# EasyEDA Pro project 通用F405飞控_2025-10-26.epro, board PCB2
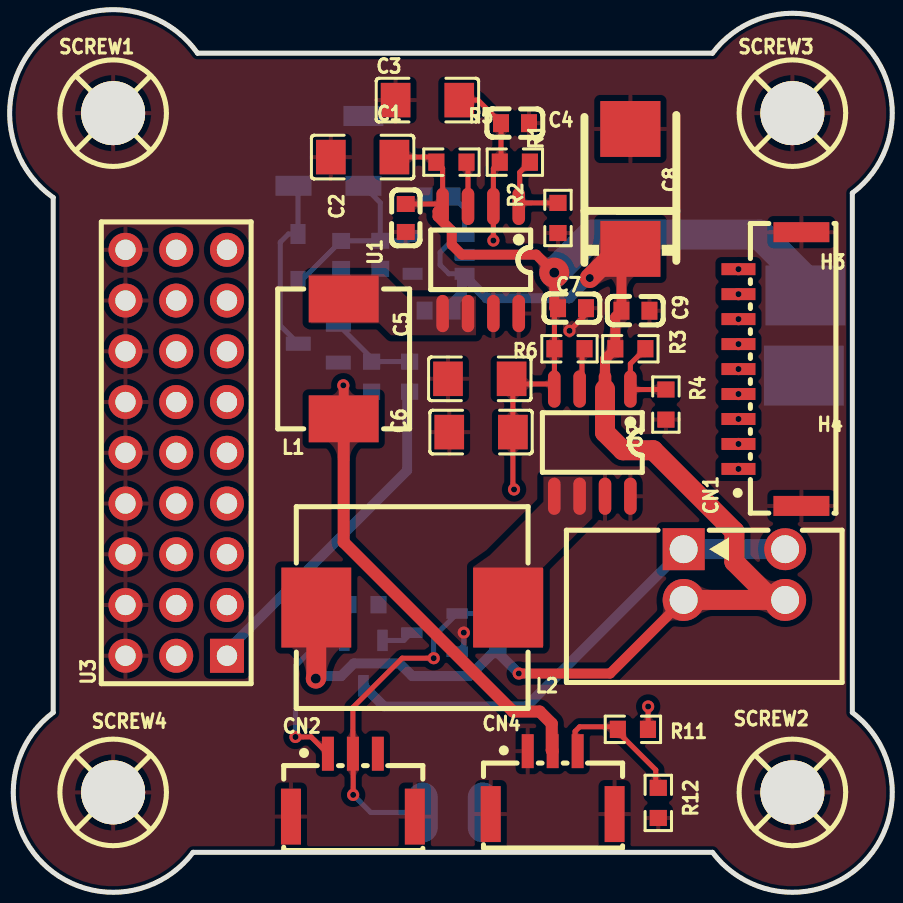
[diagram p5: board, top side]
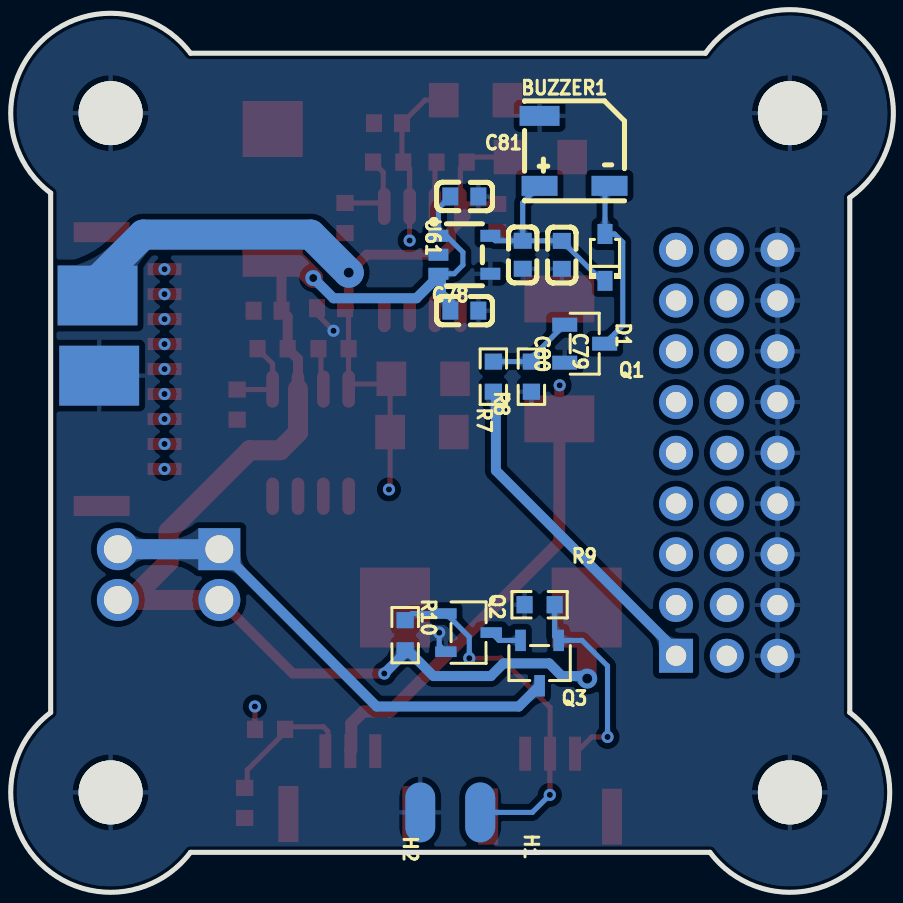
[diagram p6: board, bottom side, seen from below]

Outline 44.18 x 44.18 mm; copper layers: Top Layer, Inner1, Inner2, Bottom Layer. Coordinates in mm from the lower left corner of the outline.
Outline path: 2.18,34.77 arc(1.52,42.66) 9.41,42 35.18,42 arc(42.72,42.53) 42.18,35 42.18,9 arc(42.72,1.46) 35.18,2 9.18,2 arc(1.65,1.46) 2.18,9 2.18,34.77
Stack: Top Layer 0.035mm 外层铜厚1oz / Dielectric1 0.2104mm 7628 RC49% 8.6mil / Inner1 0.0152mm 内层铜厚 / Dielectric2 1.065mm 1.1mm H/HOZ Copper / Inner2 0.0152mm 内层铜厚 / Dielectric3 0.2104mm 7628 RC49% 8.6mil / Bottom Layer 0.035mm 外层铜厚1oz

## Design rules (mm)
template: JLCPCB Capability(Two Layers Board)
spacing copperThickness1oz (default): track to track 0.102, other pairs 0.152 to 0.3
spacing copperThickness2oz: track to track 0.203, other pairs 0.152 to 0.3
track width copperThickness1oz (default): min 0.127, default 0.254, max 2.54
track width copperThickness2oz: min 0.203, default 0.254, max 2.54
differential pair differentialPair (default): width min 0.127, default 0.254, max 2.54; gap min 0.152, default 0.152
via viaSize (default): diameter min 0.5, default 0.61, max 10; hole min 0.3, default 0.305, max 6.3

## Placement (name value [footprint] x y rotation side)
BUZZER1  4kHz  [BUZ-SMD_FST-5020]  15.96 37.11 180 bottom
C1  10uF  [C1206]  17.67 36.8 180 top
C2  100nF  [C0603]  19.83 33.75 270 top
C3  10uF  [C1206]  20.91 39.65 0 top
C4  100nF  [C0603]  25.3 38.5 0 top
C5  10uF  [C1206]  23.54 25.7 180 top
C6  10uF  [C1206]  23.6 23.03 180 top
C7  100nF  [C0603]  28.15 29.23 0 top
C8  330uF  [CASE-D_7343]  31.07 35.2 270 top
C9  100nF  [C0603]  31.33 29.11 0 top
C78  100nF  [C0603]  21.48 29.11 0 bottom
C79  100nF  [C0603]  16.6 31.9 90 bottom
C80  10uF  [C0603]  18.55 31.91 90 bottom
C81  10uF  [C0603]  21.48 34.83 0 bottom
CN1  WAFER-GH1.25-9PWB  [CONN-SMD_9P-P1.25_XUNPU_WAFER-GH1.25-9PWB]  38.06 26.19 90 top
CN2  gpio  [CONN-TH_3P-P1.25_GH1.25]  17.18 5.36 0 top
CN3  2stage_fire  [CONN-TH_2P-P2.54_KF141R-2.54-2P]  36.28 15.9 270 top
CN4  power  [CONN-TH_3P-P1.25_GH1.25]  27.18 5.49 0 top
D1  1N4148WS  [SOD-323_L1.8-W1.3-LS2.5-RD]  14.44 31.77 90 bottom
H1  safe  [焊盘]  20.68 4 90 bottom
H2  -  [焊盘]  23.68 4 90 bottom
H3  -  [电池焊盘]  39.84 29.87 0 top
H4  -  [电池焊盘]  39.76 25.86 0 top
L1  10uH  [IND-SMD_L7.3-W6.8]  16.72 26.69 270 top
L2  10uH  [IND-SMD_L11.6-W10.1]  20.15 14.25 180 top
Q1  SS8050  [SOT-23-3_L2.9-W1.3-P1.90-LS2.4-BR]  15.45 27.46 0 bottom
Q2  SI2300_C727150  [SOT-23-3_L2.9-W1.4-P1.91-LS2.6-BR]  21.27 12.99 0 bottom
Q3  SI2300_C727150  [SOT-23-3_L2.9-W1.4-P1.91-LS2.6-BR]  17.71 11.47 90 bottom
R1  100kΩ  [R0603]  25.29 36.54 0 top
R2  24.9kΩ  [R0603]  27.45 33.75 270 top
R3  100kΩ  [R0603]  31.07 27.2 0 top
R4  24.9kΩ  [R0603]  32.85 24.41 270 top
R5  100kΩ  [R0603]  22.12 36.54 180 top
R6  100kΩ  [R0603]  28.03 27.2 180 top
R7  1kΩ  [R0603]  20.03 25.81 90 bottom
R8  10kΩ  [R0603]  18.12 25.81 270 bottom
R9  10k  [R0603]  17.71 14.39 0 bottom
R10  10k  [R0603]  24.44 12.87 90 bottom
R11  20kΩ  [R0603]  31.2 8.15 0 top
R12  1kΩ  [R0603]  32.47 4.47 90 top
SCREW1  -  [M3螺丝]  5.18 39 0 top
SCREW2  -  [M3螺丝]  39.18 5 0 top
SCREW3  -  [M3螺丝]  39.18 39 0 top
SCREW4  -  [M3螺丝]  5.18 5 0 top
U1  NDP23511KC  [SOP-8_L4.9-W3.9-P1.27-LS6.0-BL]  23.58 31.65 180 top
U2  NDP23511KC  [SOP-8_L4.9-W3.9-P1.27-LS6.0-BL]  29.17 22.5 180 top
U3  KH-2.54PH180-3X9P-L11.5  [HDR-TH_27P-P2.54-V-M-R3-C9-S5.08]  8.34 22 90 top
U61  ME6217C33M5G  [SOT-23-5_L3.0-W1.7-P0.95-LS2.8-BR]  21.48 31.91 0 bottom

## Footprints (pads in the part's own frame, mm; a bottom-side part is the same pattern mirrored in y, then rotated)
BUZ-SMD_FST-5020
  rect 1.8x1 smd: 1(-1.75,-1.75) 2(1.75,-1.75)
  rect 2x1 smd: 3(-1.75,1.75)
C0603
  rect 0.8x0.9 smd: 1(-0.7,0) 2(0.7,0)
C1206
  rect 1.485x1.728 smd: 1(-1.593,0) 2(1.593,0)
CASE-D_7343
  rect 2.799x3.01 smd: 1(3,0) 2(-3,0)
CONN-SMD_9P-P1.25_XUNPU_WAFER-GH1.25-9PWB
  rect 0.6x1.7 smd: 1(-5,1.575) 2(-3.75,1.575) 3(-2.5,1.575) 4(-1.25,1.575) 5(0,1.575) 6(1.25,1.575) 7(2.5,1.575) 8(3.75,1.575) 9(5,1.575)
  rect 1x2.8 smd: 10(6.85,-1.575) 11(-6.85,-1.575)
CONN-TH_2P-P2.54_KF141R-2.54-2P
  round 2.1 hole 1.4: 1(-1.27,2.54) 2(1.27,2.54) 2(1.27,-2.54)
  rect 2.1x2.1 hole 1.4: 1(-1.27,-2.54)
CONN-TH_3P-P1.25_GH1.25
  rect 0.6x1.7 smd: 1(-1.25,1.575) 2(0,1.575) 3(1.25,1.575)
  rect 1x2.8 smd: 4(3.1,-1.575) 5(-3.1,-1.575)
HDR-TH_27P-P2.54-V-M-R3-C9-S5.08
  rect 1.7x1.7 hole 1.02: 1(-10.16,-2.54)
  round 1.7 hole 1.02: 2(-10.16,0) 3(-10.16,2.54) 4(-7.62,-2.54) 5(-7.62,0) 6(-7.62,2.54) 7(-5.08,-2.54) 8(-5.08,0) 9(-5.08,2.54) 10(-2.54,-2.54) 11(-2.54,0) 12(-2.54,2.54) 13(0,-2.54) 14(0,0) 15(0,2.54) 16(2.54,-2.54) 17(2.54,0) 18(2.54,2.54) 19(5.08,-2.54) 20(5.08,0) 21(5.08,2.54) 22(7.62,-2.54) 23(7.62,0) 24(7.62,2.54) 25(10.16,-2.54) 26(10.16,0) 27(10.16,2.54)
IND-SMD_L7.3-W6.8
  rect 2.35x3.5 smd: 1(-3,0) 2(3,0)
IND-SMD_L11.6-W10.1
  rect 3.5x4 smd: 1(-4.8,0) 2(4.8,0)
M3螺丝
  round 3.2 hole 3.2: 1(0,0)
R0603
  rect 0.806x0.864 smd: 1(-0.753,0) 2(0.753,0)
SOD-323_L1.8-W1.3-LS2.5-RD
  rect 1x0.75 smd: 1(-1.173,0) 2(1.173,0)
SOP-8_L4.9-W3.9-P1.27-LS6.0-BL
  oval 0.63x1.865 smd: 1(-1.905,-2.683) 2(-0.635,-2.683) 3(0.635,-2.683) 4(1.905,-2.683) 5(1.905,2.683) 6(0.635,2.683) 7(-0.635,2.683) 8(-1.905,2.683)
SOT-23-3_L2.9-W1.3-P1.90-LS2.4-BR
  rect 1.25x0.7 smd: 1(1,-0.95) 2(1,0.95) 3(-1,0)
SOT-23-3_L2.9-W1.4-P1.91-LS2.6-BR
  rect 1.07x0.532 smd: 1(1.135,-0.955) 2(1.135,0.955) 3(-1.135,0)
SOT-23-5_L3.0-W1.7-P0.95-LS2.8-BR
  rect 1x0.6 smd: 1(1.3,-0.95) 2(1.3,0) 3(1.3,0.95) 4(-1.3,0.95) 5(-1.3,-0.95)
焊盘
  oval 3x1.5 smd: 1(0,0)
电池焊盘
  rect 4x3 smd far side: 1(0,0)

## Nets
As in the schematic.

Pads without a net: CN2 3

## Via types
v1: diameter 0.61, hole 0.305, Top Layer to Bottom Layer, 19 vias
v2: diameter 1.5, hole 0.5, Top Layer to Bottom Layer, 1 via
v3: diameter 0.8, hole 0.4, Top Layer to Bottom Layer, 1 via
v4: diameter 1, hole 0.5, Top Layer to Bottom Layer, 1 via

## Routing (per net, layer and track width the routed paths; a pad name or vN(x,y) marks a point on that pad's centre or on a via; arc(x,y) is an arc through that point)
3V3: length 9.8
  Bottom Layer w0.254: D1.1 14.6,30.6 C79.2 16.6,32.61 C80.2 ; U61.5 19.93,32.61 C80.2 ; C80.2 18.55,34.52 BUZZER1.1
GND: length 2.6
  Top Layer w0.254: v1(28.03,28.1) 28.85,28.93 C7.2
  Bottom Layer w0.254: v1(22.74,12.99) 22.74,12.37 Q2.2
ADC_BAT: length 7
  Top Layer w0.254: R12.2 32.34,5.35 32.34,6.12 30.19,8.28 28.53,8.28 28.31,8.05 28.31,7.19 CN4.3
FC5V: length 42.6
  Top Layer w0.254: v1(24.22,32.62) U1.2 24.22,36.22 R1.1 24.6,36.6 C4.1 23.45,39.65 C3.2
  Top Layer w0.5: L1.2 16.72,25.36 v1(16.71,25.37)
  Top Layer w0.6: L1.2 16.72,17.52 25.2,9.04 26.54,9.04 27.14,8.44 27.14,7.11 CN4.2
  Inner1 w0.5: v1(24.22,32.62) 23.95,32.62 v1(16.71,25.37)
GPIO1: length 10.4
  Top Layer w0.254: CN2.1 15.1,7.77 v1(14.31,7.77)
  Bottom Layer w0.254: R9.1 16.96,12.81 Q3.1 15.59,12.61 14.31,11.33 v1(14.31,7.77)
GPIO2: length 18.2
  Top Layer w0.254: v1(17.2,4.87) 17.2,6.92 CN2.2 17.18,9.25 19.65,11.71 v1(21.23,11.71)
  Bottom Layer w0.254: v1(17.2,4.87) 18.07,4 H1.1 ; R10.2 24.11,13.95 Q2.1 21.23,12.78 v1(21.23,11.71)
IN+: length 57.9
  Top Layer w0.254: v1(25.25,20.16) 25.19,20.22 C6.1 25.19,25.64 C5.1 25.38,25.7 25.64,25.44 27.01,25.44 U2.4 27.27,25.19 R6.2 27.27,29.05 ; C2.1 21.56,34.45 U1.4 21.68,36.23 R5.2 21.11,36.8 C1.1 ; v1(31.96,9.3) 31.96,8.16 R11.2 ; v2(27.26,31.01) 26.88,31.39
  Top Layer w0.5: 26.88,31.39 26.36,31.91 22.63,31.91 22.13,32.41 22.13,33.11 21.42,33.82 21.42,34.08 U1.4 ; 27.27,29.23 27.26,29.23 v2(27.26,31.01)
  Inner1 w0.254: v1(25.25,20.16) 31.96,13.45 v1(31.96,9.3)
  Bottom Layer w1.5: v2(27.26,31.01) 29.17,32.92 37.55,32.92 39.84,30.63 H3.1
SER5V: length 80.1
  Top Layer w0.5: C8.1 30.63,31.76 C9.1 30.32,28.8 R3.1 29.8,26.69 U2.2 ; 33.74,14.63 30.06,10.95 v1(25.49,10.95) ; 15.35,10.72 v4(15.33,10.69)
  Top Layer w1: 38.19,14.63 33.74,14.63 ; 38.19,14.63 CN3.2 ; 38.19,14.63 36.28,16.53 36.28,18.06 32.22,22.12 30.69,22.12 29.8,23.01 U2.2 ; v3(29.04,30.74) 30.06,31.76 30.63,31.76 ; L2.2 15.35,10.72
  Inner1 w1: v4(15.33,10.69) 15.33,9.8 14.44,8.91 10.12,8.91 8.34,10.69 U3.2
  Bottom Layer w0.254: C81.2 22.78,34.23 U61.1 22.71,32.92 22.44,32.92 21.55,32.03 21.55,31.39 21.99,30.96 U61.3
  Bottom Layer w0.5: 29.04,30.74 28.03,29.73 23.88,29.73 22.65,30.96 22.65,29.97 22.18,29.49 C78.2 ; v1(25.49,10.95) 24.44,11.99 R10.1 24.31,12.11 23.02,10.82 20.15,10.82 19.52,11.45 17.23,11.45 16.6,10.82 15.45,10.82 v4(15.33,10.69)
TIM1_CH1/GPIO7: length 46.5
  Inner2 w0.254: v1(36.48,21.19) 20.23,21.19 U3.1
  Bottom Layer w0.5: R7.1 19.9,24.93 19.9,21.11 10.88,12.09 U3.1
TIM1_CH2/GPIO8: length 28.9
  Inner2 w0.254: U3.4 18.94,22.44 v1(36.48,22.44)
TIM1_CH3/GPIO9: length 28.4
  Inner2 w0.254: U3.7 17.65,23.69 v1(36.48,23.69)
TIM2_CH1: length 27.9
  Inner2 w0.254: U3.10 16.21,24.79 36.34,24.79 v1(36.48,24.94)
TIM2_CH2: length 27.3
  Inner2 w0.254: U3.13 15.07,26.19 v1(36.48,26.19)
TIM3_CH1: length 26.8
  Inner2 w0.254: v1(36.48,27.44) 13.78,27.44 U3.16
TIM3_CH2: length 26.3
  Inner2 w0.254: U3.19 12.49,28.69 v1(36.48,28.69)
TIM3_CH3: length 25.7
  Inner2 w0.254: v1(36.48,29.94) 11.2,29.94 U3.22
TIM3_CH4: length 27.3
  Inner2 w0.254: U3.25 11.9,31.14 24.22,31.14 25.61,32.54 35.39,32.54 36.48,31.44 v1(36.48,31.19)
$1N427: length 4.5
  Top Layer w0.254: R1.2 25.54,36.04 25.54,34.89 25.49,34.84 U1.1 25.66,34.5 R2.1
$1N432: length 2.2
  Top Layer w0.254: U1.3 22.95,36.47 22.87,36.54
$1N848: length 4.1
  Top Layer w0.254: R3.2 31.07,26.45 U2.1 31.1,25.16 R4.1
$1N850: length 2.1
  Top Layer w0.254: R6.1 28.65,27.08 28.65,25.43 28.53,25.31 U2.3
$1N2141: length 9
  Bottom Layer w0.254: Q1.3 13.55,28.36 13.55,32.54 13.96,32.95 D1.2 14.44,35.13 BUZZER1.2
$1N2142: length 4.4
  Bottom Layer w0.254: Q1.1 18.12,26.74 R8.1 R7.2
$1N2890: length 24.8
  Bottom Layer w0.5: 33.74,17.17 25.87,9.3 18.75,9.3 Q3.3
  Bottom Layer w1: CN3.1 33.74,17.17
$1N2891: length 1.6
  Bottom Layer w0.254: 18.67,12.61 19.74,12.61 Q2.3

## Copper pours and planes (outline as drawn; the poured copper is in the pictures)
GND on Top Layer: -5.25,50.06 46.95,50.06 46.95,-4.93 -5.25,-4.93
GND on Bottom Layer: -4.36,47.52 47.58,47.52 47.58,-3.79 -4.36,-3.79
GND on Bottom Layer: -3.22,46.51 46.06,46.51 46.06,-2.64 -3.22,-2.64
GND on Inner1: -4.36,47.01 49.49,47.01 49.49,-2.39 -4.36,-2.39
GND on Inner2: -5.5,49.43 52.41,49.43 52.41,-4.17 -5.5,-4.17
SER5V on Inner1: 7.2,33.55 9.44,33.55 9.44,10.44 7.2,10.44
$1N431 on Top Layer: 15.05,30.95 23.34,30.95 23.34,27.88 15.05,27.88
$1N849 on Top Layer: 23.2,20.81 29.17,20.81 29.17,12.32 23.2,12.32

Small or netless copper shapes (teardrops, artwork), in the pictures only: 71 on Top Layer, 45 on Bottom Layer, 5 on Inner1, 18 on Inner2
